# EAGLE design tact-switches (EAGLE 7.7.0)
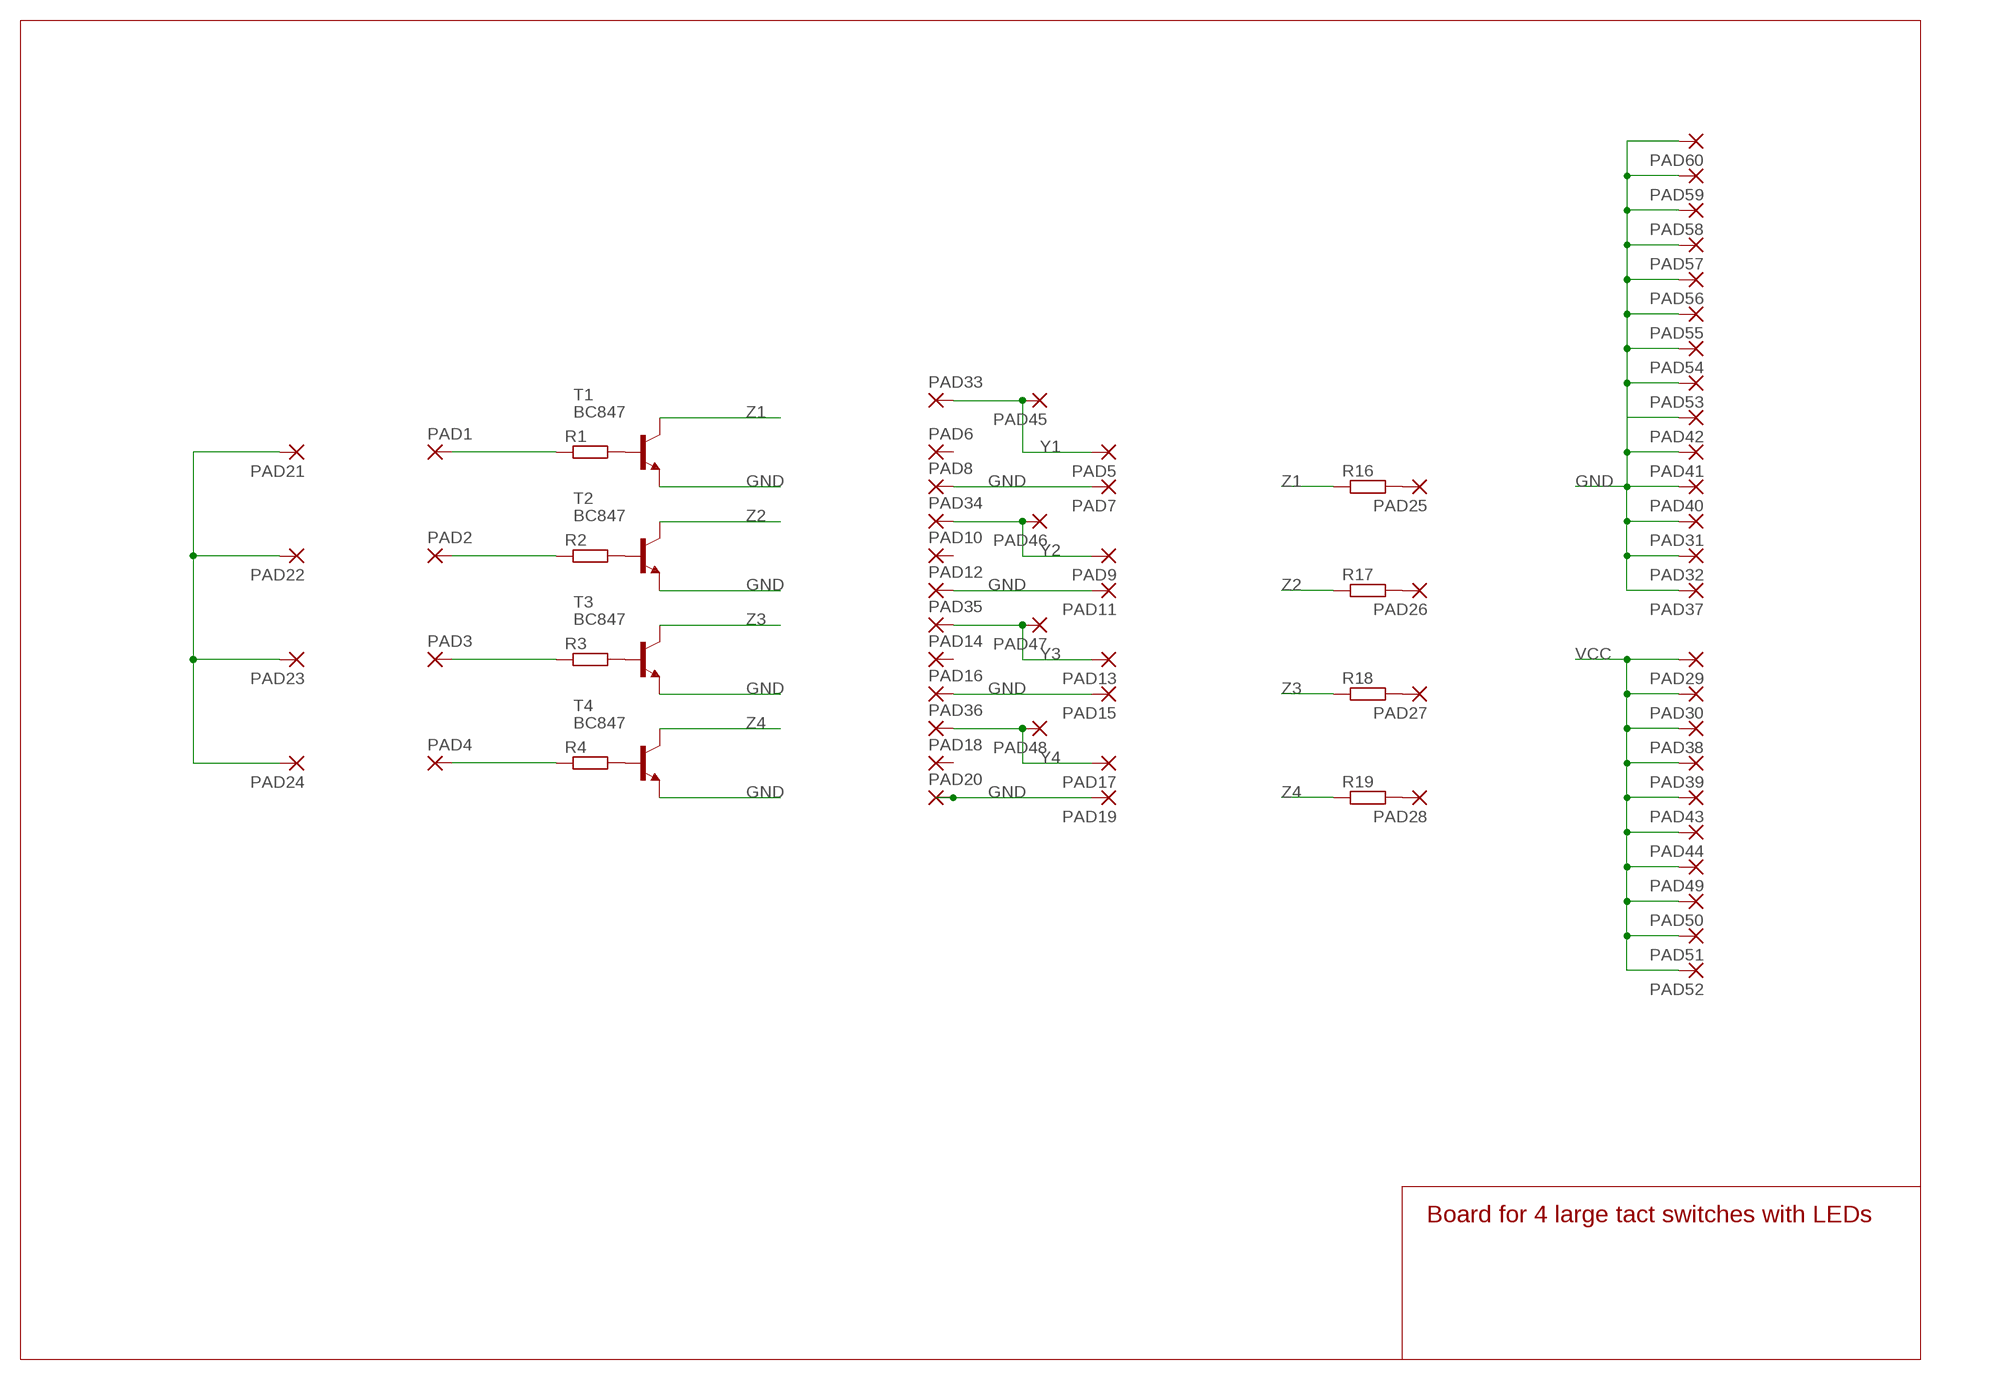
[diagram p0: schematic, sheet 1]

## Parts
PAD1  1,6/0,8  [1,6/0,8]
PAD2  1,6/0,8  [1,6/0,8]
PAD3  1,6/0,8  [1,6/0,8]
PAD4  1,6/0,8  [1,6/0,8]
PAD5  1,6/0,8  [1,6/0,8]
PAD6  1,6/0,8  [1,6/0,8]
PAD7  1,6/0,8  [1,6/0,8]
PAD8  1,6/0,8  [1,6/0,8]
PAD9  1,6/0,8  [1,6/0,8]
PAD10  1,6/0,8  [1,6/0,8]
PAD11  1,6/0,8  [1,6/0,8]
PAD12  1,6/0,8  [1,6/0,8]
PAD13  1,6/0,8  [1,6/0,8]
PAD14  1,6/0,8  [1,6/0,8]
PAD15  1,6/0,8  [1,6/0,8]
PAD16  1,6/0,8  [1,6/0,8]
PAD17  1,6/0,8  [1,6/0,8]
PAD18  1,6/0,8  [1,6/0,8]
PAD19  1,6/0,8  [1,6/0,8]
PAD20  1,6/0,8  [1,6/0,8]
PAD21  1,6/0,8  [1,6/0,8]
PAD22  1,6/0,8  [1,6/0,8]
PAD23  1,6/0,8  [1,6/0,8]
PAD24  1,6/0,8  [1,6/0,8]
PAD25  1,6/0,8  [1,6/0,8]
PAD26  1,6/0,8  [1,6/0,8]
PAD27  1,6/0,8  [1,6/0,8]
PAD28  1,6/0,8  [1,6/0,8]
PAD29  1,6/0,8  [1,6/0,8]
PAD30  1,6/0,8  [1,6/0,8]
PAD31  1,6/0,8  [1,6/0,8]
PAD32  1,6/0,8  [1,6/0,8]
PAD33  1,6/0,8  [1,6/0,8]
PAD34  1,6/0,8  [1,6/0,8]
PAD35  1,6/0,8  [1,6/0,8]
PAD36  1,6/0,8  [1,6/0,8]
PAD37  1,6/0,8  [1,6/0,8]
PAD38  1,6/0,8  [1,6/0,8]
PAD39  1,6/0,8  [1,6/0,8]
PAD40  1,6/0,8  [1,6/0,8]
PAD41  1,6/0,8  [1,6/0,8]
PAD42  1,6/0,8  [1,6/0,8]
PAD43  1,6/0,8  [1,6/0,8]
PAD44  1,6/0,8  [1,6/0,8]
PAD45  1,6/0,8  [1,6/0,8]
PAD46  1,6/0,8  [1,6/0,8]
PAD47  1,6/0,8  [1,6/0,8]
PAD48  1,6/0,8  [1,6/0,8]
PAD49  1,6/0,8  [1,6/0,8]
PAD50  1,6/0,8  [1,6/0,8]
PAD51  1,6/0,8  [1,6/0,8]
PAD52  1,6/0,8  [1,6/0,8]
PAD53  1,6/0,8  [1,6/0,8]
PAD54  1,6/0,8  [1,6/0,8]
PAD55  1,6/0,8  [1,6/0,8]
PAD56  1,6/0,8  [1,6/0,8]
PAD57  1,6/0,8  [1,6/0,8]
PAD58  1,6/0,8  [1,6/0,8]
PAD59  1,6/0,8  [1,6/0,8]
PAD60  1,6/0,8  [1,6/0,8]
R1  R-EU_M0805  [M0805]
R2  R-EU_M0805  [M0805]
R3  R-EU_M0805  [M0805]
R4  R-EU_M0805  [M0805]
R16  R-EU_M0805  [M0805]
R17  R-EU_M0805  [M0805]
R18  R-EU_M0805  [M0805]
R19  R-EU_M0805  [M0805]
T1  BC847  [SOT23]
T2  BC847  [SOT23]
T3  BC847  [SOT23]
T4  BC847  [SOT23]

## Nets
GND: PAD7.1(P) PAD8.1(P) PAD11.1(P) PAD12.1(P) PAD15.1(P) PAD16.1(P) PAD19.1(P) PAD20.1(P) PAD31.1(P) PAD32.1(P) PAD37.1(P) PAD40.1(P) PAD41.1(P) PAD42.1(P) PAD53.1(P) PAD54.1(P) PAD55.1(P) PAD56.1(P) PAD57.1(P) PAD58.1(P) PAD59.1(P) PAD60.1(P) T1.2(E) T2.2(E) T3.2(E) T4.2(E)
N$1: R1.2 T1.1(B)
N$2: R2.2 T2.1(B)
N$3: R3.2 T3.1(B)
N$4: R4.2 T4.1(B)
N$5: PAD1.1(P) R1.1
N$6: PAD2.1(P) R2.1
N$7: PAD3.1(P) R3.1
N$8: PAD4.1(P) R4.1
N$9: PAD21.1(P) PAD22.1(P) PAD23.1(P) PAD24.1(P)
N$10: PAD25.1(P) R16.2
N$11: PAD26.1(P) R17.2
N$12: PAD27.1(P) R18.2
N$13: PAD28.1(P) R19.2
VCC: PAD29.1(P) PAD30.1(P) PAD38.1(P) PAD39.1(P) PAD43.1(P) PAD44.1(P) PAD49.1(P) PAD50.1(P) PAD51.1(P) PAD52.1(P)
Y1: PAD5.1(P) PAD33.1(P) PAD45.1(P)
Y2: PAD9.1(P) PAD34.1(P) PAD46.1(P)
Y3: PAD13.1(P) PAD35.1(P) PAD47.1(P)
Y4: PAD17.1(P) PAD36.1(P) PAD48.1(P)
Z1: R16.1 T1.3(C)
Z2: R17.1 T2.3(C)
Z3: R18.1 T3.3(C)
Z4: R19.1 T4.3(C)
Unconnected: PAD6.1(P) PAD10.1(P) PAD14.1(P) PAD18.1(P)

## Notes on the sheet
- Board for 4 large tact switches with LEDs

## Library data of the parts
PAD1-PAD60 = wirepad:1,6/0,8: THROUGH-HOLE PAD
R1-R4 R16-R19 = rcl:R-EU_: RESISTOR, European symbol
T1-T4 = transistor:BC847: NPN TRANSISTOR

## Board
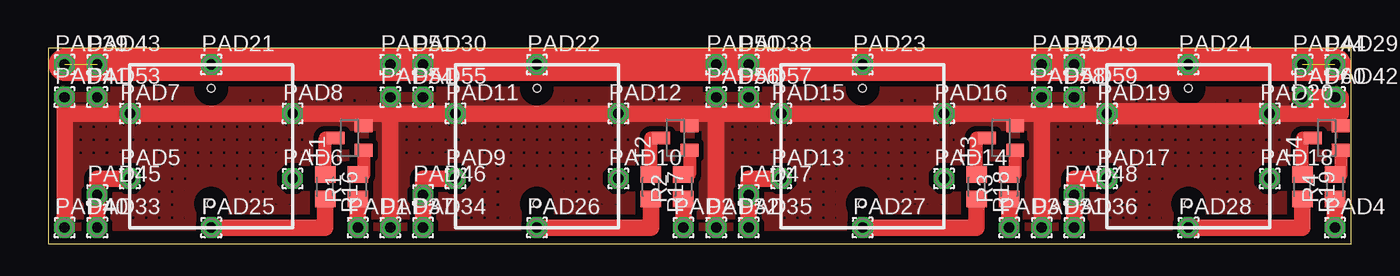
[diagram p1: board, top side]

Size 101.6 x 15.24 mm. Coordinates in mm from the lower left corner, seen from the top.
Outline: 0,0 101.6,0 101.6,15.24 0,15.24 0,0
Copper layers (1*16): Top 0.035mm / dielectric 1.5mm / Bottom 0.035mm
Design rules "default": minimum track width 10mil, minimum drill 24mil, track to track 8mil, track to pad 8mil, pad to pad 8mil, via to via 8mil, smd to smd 8mil, copper to edge 40mil, drill to drill 8mil, minimum pad ring 10mil, minimum via ring 8mil, stop-mask expansion 4mil, vias tented up to drill 0mil, thermal gap 10mil
Holes 0.6 mm at 12.7,12.12 38.1,3.12 38.1,12.12 63.5,12.12 88.9,12.12 63.5,3.12 88.9,3.12 12.7,3.12

### Footprints (pad centres in the part's own frame; a part is rotated, then mirrored left to right if it is on the bottom)
1,6/0,8 = drill 0.813 pad 1.6 octagon: 1 0,0
M0805 = smd 1.3 x 1.6: 1 -0.95,0; 2 0.95,0
SOT23 = smd 1 x 1.4: 1 -0.95,-1.1; 2 0.95,-1.1; 3 0,1.1

### Placement (x,y rotation side)
PAD1  24.13,1.27 0 top
PAD2  49.53,1.27 0 top
PAD3  74.93,1.27 0 top
PAD4  100.33,1.27 0 top
PAD5  6.35,5.08 0 top
PAD6  19.05,5.08 0 top
PAD7  6.35,10.16 0 top
PAD8  19.05,10.16 0 top
PAD9  31.75,5.08 0 top
PAD10  44.45,5.08 0 top
PAD11  31.75,10.16 0 top
PAD12  44.45,10.16 0 top
PAD13  57.15,5.08 0 top
PAD14  69.85,5.08 0 top
PAD15  57.15,10.16 0 top
PAD16  69.85,10.16 0 top
PAD17  82.55,5.08 0 top
PAD18  95.25,5.08 0 top
PAD19  82.55,10.16 0 top
PAD20  95.25,10.16 0 top
PAD21  12.7,13.97 0 top
PAD22  38.1,13.97 0 top
PAD23  63.5,13.97 0 top
PAD24  88.9,13.97 0 top
PAD25  12.7,1.27 0 top
PAD26  38.1,1.27 0 top
PAD27  63.5,1.27 0 top
PAD28  88.9,1.27 0 top
PAD29  100.33,13.97 0 top
PAD30  29.21,13.97 0 top
PAD31  77.47,1.27 0 top
PAD32  52.07,1.27 0 top
PAD33  3.81,1.27 0 top
PAD34  29.21,1.27 0 top
PAD35  54.61,1.27 0 top
PAD36  80.01,1.27 0 top
PAD37  26.67,1.27 0 top
PAD38  54.61,13.97 0 top
PAD39  1.27,13.97 0 top
PAD40  1.27,1.27 0 top
PAD41  1.27,11.43 0 top
PAD42  100.33,11.43 0 top
PAD43  3.81,13.97 0 top
PAD44  97.79,13.97 0 top
PAD45  3.81,3.81 0 top
PAD46  29.21,3.81 0 top
PAD47  54.61,3.81 0 top
PAD48  80.01,3.81 0 top
PAD49  80.01,13.97 0 top
PAD50  52.07,13.97 0 top
PAD51  26.67,13.97 0 top
PAD52  77.47,13.97 0 top
PAD53  3.81,11.43 0 top
PAD54  26.67,11.43 0 top
PAD55  29.21,11.43 0 top
PAD56  52.07,11.43 0 top
PAD57  54.61,11.43 0 top
PAD58  77.47,11.43 0 top
PAD59  80.01,11.43 0 top
PAD60  97.79,11.43 0 top
R1  24.13,4.45 90 top
R2  49.53,4.45 90 top
R3  74.93,4.45 90 top
R4  100.33,4.45 90 top
R16  21.59,4.45 270 top
R17  46.99,4.45 270 top
R18  72.39,4.45 270 top
R19  97.79,4.45 270 top
T1  23.5,8.25 90 top
T2  48.9,8.25 90 top
T3  74.3,8.25 90 top
T4  99.69,8.25 90 top

### Tracks (layer width: path | path; a pad name or v marks a point on that pad's centre or on a via)
GND
  Top 1.016: T2.2 49.99,10.16 50.8,10.16 | T1.2 24.59,10.16 25.4,10.16 | T3.2 75.39,10.16 76.2,10.16 | T4.2 100.8,10.16
  Top 1.27: 26.67,10.16 29.21,10.16 | 29.21,10.16 PAD11.1 PAD12.1 50.8,10.16 52.07,10.16 | 52.07,10.16 54.61,10.16 | 54.61,10.16 PAD15.1 PAD16.1 76.2,10.16 77.47,10.16 | 77.47,10.16 80.01,10.16 | 80.01,10.16 PAD19.1 | PAD20.1 100.8,10.16 100.8,11.43 PAD42.1 PAD60.1 | PAD31.1 77.47,10.16 | PAD32.1 52.07,10.16 | PAD37.1 26.67,10.16 | 26.67,10.16 25.4,10.16 PAD8.1 PAD7.1 3.81,10.16 | PAD40.1 1.27,10.16 | 1.27,10.16 3.81,10.16 | PAD41.1 1.27,10.16 | PAD58.1 77.47,10.16 | PAD59.1 80.01,10.16 | PAD57.1 54.61,10.16 | PAD56.1 52.07,10.16 | PAD55.1 29.21,10.16 | PAD54.1 26.67,10.16 | PAD53.1 3.81,10.16
  Top 1.676: PAD19.1 PAD20.1
  pour Top (isolate 0.406, hatched): 0,0 101.6,0 101.6,15.24 0,15.24
N$1
  Top 1.016: T1.1 24.59,5.39 R1.2
N$2
  Top 1.016: T2.1 49.99,5.39 R2.2
N$3
  Top 1.016: T3.1 75.39,5.39 R3.2
N$4
  Top 1.016: T4.1 100.8,5.39 R4.2
N$5
  Top 1.27: PAD1.1 R1.1
N$6
  Top 1.27: PAD2.1 R2.1
N$7
  Top 1.27: PAD3.1 R3.1
N$8
  Top 1.27: PAD4.1 R4.1
N$9
  Top 2.54: PAD21.1 PAD22.1 PAD23.1 PAD24.1
N$10
  Top 1.27: PAD25.1 21.59,1.27 R16.2
N$11
  Top 1.27: PAD26.1 46.99,1.27 R17.2
N$12
  Top 1.27: PAD27.1 72.39,1.27 R18.2
N$13
  Top 1.27: PAD28.1 97.79,1.27 R19.2
VCC  (2 unrouted)
  Top 1.27: 27.94,13.97 PAD50.1 | 53.98,13.97 PAD51.1
  Top 2.54: PAD39.1 PAD51.1 27.94,13.97 PAD30.1 PAD50.1 53.98,13.97 PAD38.1 PAD52.1 PAD49.1 PAD29.1
Y1
  Top 1.27: PAD33.1 PAD45.1 3.81,5.08 PAD5.1
Y2
  Top 1.27: PAD34.1 PAD46.1 29.21,5.08 PAD9.1
Y3
  Top 1.27: PAD35.1 PAD47.1 54.61,5.08 PAD13.1
Y4
  Top 1.27: PAD36.1 PAD48.1 80.01,5.08 PAD17.1
Z1
  Top 1.016: R16.1 21.59,8.25 T1.3
Z2
  Top 1.016: R17.1 46.99,8.25 T2.3
Z3
  Top 1.016: R18.1 72.39,8.25 T3.3
Z4
  Top 1.016: R19.1 97.79,8.25 T4.3